# EAGLE design ESPRemote (EAGLE 9.3.2)
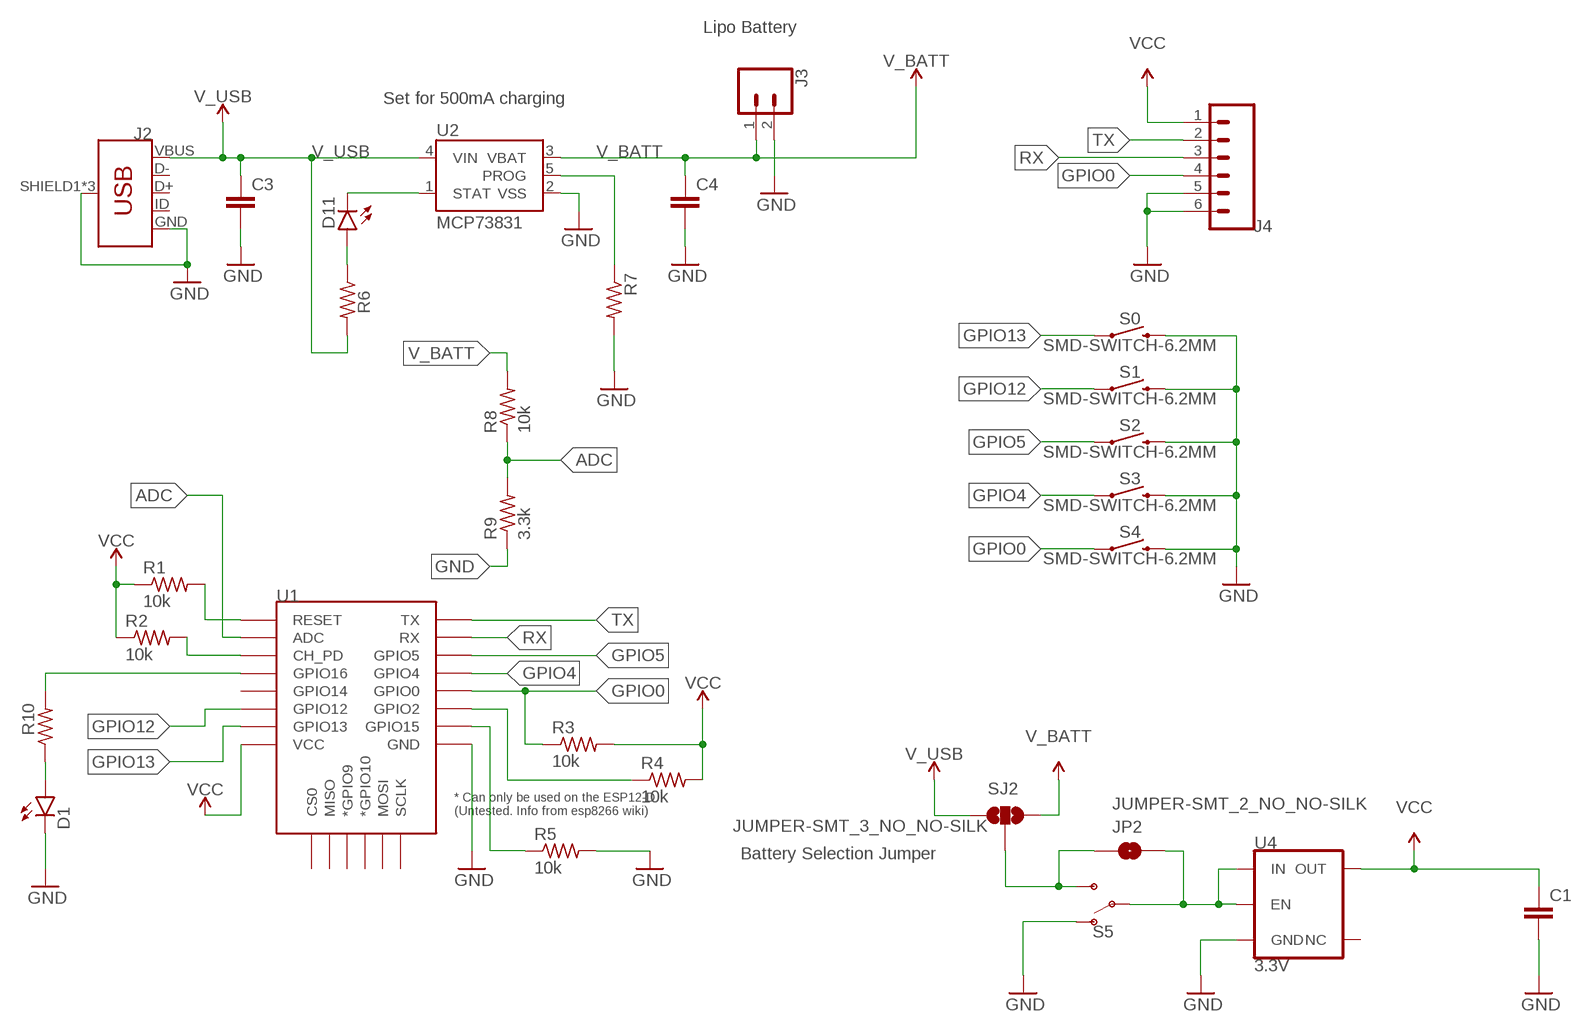
[diagram p0: schematic, sheet 1]

## Parts
C1  10UF  [C0603]
C3  10UF  [C0603]
C4  10UF  [C0603]
D1  BLUE  LEDCHIP-LED0805  [CHIP-LED0805]
D11  RED  LEDCHIP-LED0805  [CHIP-LED0805]
J2  USB_MICRO-B_FEMALE-SMT  [USB-B-MICRO-SMD]
J3  CONN_02  [1X02]
J4  CONN_06SMD-1MM  [1X06-1MM]
JP2  JUMPER-SMT_2_NO_NO-SILK  [SMT-JUMPER_2_NO_NO-SILK]
R1  10k  R-US_R1206  [R1206]
R2  10k  R-US_R1206  [R1206]
R3  10k  R-US_R1206  [R1206]
R4  10k  R-US_R1206  [R1206]
R5  10k  R-US_R1206  [R1206]
R6  1k  R-US_R1206  [R1206]
R7  2.0k  R-US_R1206  [R1206]
R8  10k  R-US_R1206  [R1206]
R9  3.3k  R-US_R1206  [R1206]
R10  330  R-US_R1206  [R1206]
S0  SMD-SWITCH-6.2MM  MOMENTARY-SWITCH-SPST-SMD-6.0X3.5MM  [TACTILE_SWITCH_SMD_6.0X3.5MM]
S1  SMD-SWITCH-6.2MM  MOMENTARY-SWITCH-SPST-SMD-6.0X3.5MM  [TACTILE_SWITCH_SMD_6.0X3.5MM]
S2  SMD-SWITCH-6.2MM  MOMENTARY-SWITCH-SPST-SMD-6.0X3.5MM  [TACTILE_SWITCH_SMD_6.0X3.5MM]
S3  SMD-SWITCH-6.2MM  MOMENTARY-SWITCH-SPST-SMD-6.0X3.5MM  [TACTILE_SWITCH_SMD_6.0X3.5MM]
S4  SMD-SWITCH-6.2MM  MOMENTARY-SWITCH-SPST-SMD-6.0X3.5MM  [TACTILE_SWITCH_SMD_6.0X3.5MM]
S5  SWITCH-SPDT-SMD-RIGHT-ANGLE  [SWITCH_SPST_SMD_A]
SJ2  JUMPER-SMT_3_NO_NO-SILK  [SMT-JUMPER_3_NO_NO-SILK]
U1  ESP12ESMD  [ESP12E-SMD]
U2  MCP73831  [SOT23-5]
U4  3.3V  V_REG_AP2112K-3.3V  [SOT23-5]

## Nets
ADC: R8.1 R9.2 U1.ADC
GND: C1.2 C3.2 C4.2 D1.C J2.GND J2.SHIELD1(SHIELD) J2.SHIELD2(SHIELD) J2.SHIELD3(SHIELD) J3.2 J4.5 J4.6 R5.2 R7.2 R9.1 S0.2 S1.2 S2.2 S3.2 S4.2 S5.1(O) U1.GND U2.2(VSS) U4.2(GND)
GPIO0: J4.4 R3.1 S4.1 U1.GPIO0
GPIO4: S3.1 U1.GPIO4
GPIO5: S2.1 U1.GPIO5
GPIO12: S1.1 U1.GPIO12
GPIO13: S0.1 U1.GPIO13
N$1: JP2.2 S5.2(P) U4.1(IN) U4.3(EN)
N$2: R1.2 U1.RESET
N$3: D11.A R6.1
N$4: R2.2 U1.CH_PD
N$5: R4.1 U1.GPIO2
N$6: JP2.1 S5.3(S) SJ2.2
N$7: R5.1 U1.GPIO15
N$8: R10.2 U1.GPIO16
N$9: D1.A R10.1
PROG: R7.1 U2.5(PROG)
RX: J4.3 U1.RXD0(RX)
STAT: D11.C U2.1(STAT)
TX: J4.2 U1.TXD0(TX)
V_BATT: C4.1 J3.1 R8.2 SJ2.3 U2.3(VBAT)
V_USB: C3.1 J2.VBUS R6.2 SJ2.1 U2.4(VIN)
VCC: C1.1 J4.1 R1.1 R2.1 R3.2 R4.2 U1.VCC U4.5(OUT)
Unconnected: J2.D+ J2.D- J2.ID U1.CS0 U1.GPIO9(*GPIO9) U1.GPIO10(*GPIO10) U1.GPIO14 U1.MISO U1.MOSI U1.SCLK U4.4(NC)

## Notes on the sheet
- Lipo Battery
- Set for 500mA charging
- Battery Selection Jumper

## Library data of the parts
C1 C3 C4 = SparkFun-Capacitors:10UF: 10.0µF ceramic capacitors A capacitor is a passive two-terminal electrical component used to store electrical energy temporarily in an electric field.
D1 D11 = led:LED: LED OSRAM: - CHIPLED LG R971, LG N971, LY N971, LG Q971, LY Q971, LO R971, LY R971 LH N974, LH R974 LS Q976, LO Q976, LY Q976 LO Q996 - Hyper CHIPLED LW Q18S LB Q993, LB Q99A, LB R99A - SideLED LS A670, LO A670, LY A670, LG A670, LP A670 LB A673, LV A673, LT A673, LW A673 LH A674 LY A675 LS A676, LA A676, LO A676, LY A676, LW A676 LS A679, LY A679, LG A679 - Hyper Micro SIDELED® LS Y876, LA Y876, LO Y876, LY Y876 LT Y87S - SmartLED LW L88C, LW L88S LB L89C, LB L89S, LG L890 LS L89K, LO L89K, LY L89K LS L896, LA L896, LO L896, LY L896 - TOPLED LS T670, LO T670, LY T670, LG T670, LP T670 LSG T670, LSP T670, LSY T670, LOP T670, LYG T670 LG T671, LOG T671, LSG T671 LB T673, LV T673, LT T673, LW T673 LH T674 LS T676, LA T676, LO T676, LY T676, LB T676, LH T676, LSB T676, LW T676 LB T67C, LV T67C, LT T67C, LS T67K, LO T67K, LY T67K, LW E67C LS E67B, LA E67B, LO E67B, LY E67B, LB E67C, LV E67C, LT E67C LW T67C LS T679, LY T679, LG T679 LS T770, LO T770, LY T770, LG T770, LP T770 LB T773, LV T773, LT T773, LW T773 LH T774 LS E675, LA E675, LY E675, LS T675 LS T776, LA T776, LO T776, LY T776, LB T776 LHGB T686 LT T68C, LB T68C - Hyper Mini TOPLED® LB M676 - Mini TOPLED Santana® LG M470 LS M47K, LO M47K, LY M47K Source: http://www.osram.convergy.de LUXEON: - LUMILED® LXK2-PW12-R00, LXK2-PW12-S00, LXK2-PW14-U00, LXK2-PW14-V00 LXK2-PM12-R00, LXK2-PM12-S00, LXK2-PM14-U00 LXK2-PE12-Q00, LXK2-PE12-R00, LXK2-PE12-S00, LXK2-PE14-T00, LXK2-PE14-U00 LXK2-PB12-K00, LXK2-PB12-L00, LXK2-PB12-M00, LXK2-PB14-N00, LXK2-PB14-P00, LXK2-PB14-Q00 LXK2-PR12-L00, LXK2-PR12-M00, LXK2-PR14-Q00, LXK2-PR14-R00 LXK2-PD12-Q00, LXK2-PD12-R00, LXK2-PD12-S00 LXK2-PH12-R00, LXK2-PH12-S00 LXK2-PL12-P00, LXK2-PL12-Q00, LXK2-PL12-R00 Source: www.luxeon.com KINGBRIGHT: KA-3528ASYC Source: www.kingbright.com
J2 = SparkFun-Connectors:USB_MICRO-B: USB Type Micro-B Connector Male/female and PTH/SMT variants SparkFun Products: SparkFun microB USB Breakout <https://www.sparkfun.com/products/12035> SparkFun USB microB Plug Breakout <https://www.sparkfun.com/products/10031> SparkFun ESP8266 Thing <https://www.sparkfun.com/products/13231>; PROD_ID: CONN-11752
J3 = SparkFun-Connectors:CONN_02: Multi connection point. Often used as Generic Header-pin footprint for 0.1 inch spaced/style header connections On any of the 0.1 inch spaced packages, you can populate with these: Break Away Headers - Straight <https://www.sparkfun.com/products/116> (PRT-00116) Break Away Male Headers - Right Angle <https://www.sparkfun.com/products/553> (PRT-00553) Female Headers <https://www.sparkfun.com/products/115> (PRT-00115) Break Away Headers - Machine Pin <https://www.sparkfun.com/products/117> (PRT-00117) Break Away Female Headers - Swiss Machine Pin <https://www.sparkfun.com/products/743> (PRT-00743) For SCREWTERMINALS and SPRING TERMINALS visit here: Screw Terimnals on SparkFun.com <https://www.sparkfun.com/search/results?term=Screw+Terminals> (5mm/3.5mm/2.54mm spacing) This device is also useful as a general connection point to wire up your design to another part of your project. Our various solder wires solder well into these plated through hole pads. Hook-Up Wire - Assortment (Stranded, 22 AWG) <https://www.sparkfun.com/products/11375> (PRT-11375) Hook-Up Wire - Assortment (Solid Core, 22 AWG) <https://www.sparkfun.com/products/11367> (PRT-11367) View the entire wire category on our website here <https://www.sparkfun.com/categories/141> Special notes: Molex polarized connector foot print use with: PRT-08233 with associated crimp pins and housings. 2.54_SCREWTERM for use with PRT-10571. 3.5mm Screw Terminal footprints for PRT-08084 5mm Screw Terminal footprints for use with PRT-08432
J4 = SparkFun-Connectors:CONN_06: Multi connection point. Often used as Generic Header-pin footprint for 0.1 inch spaced/style header connections On any of the 0.1 inch spaced packages, you can populate with these: Break Away Headers - Straight <https://www.sparkfun.com/products/116> (PRT-00116) Break Away Male Headers - Right Angle <https://www.sparkfun.com/products/553> (PRT-00553) Female Headers <https://www.sparkfun.com/products/115> (PRT-00115) Break Away Headers - Machine Pin <https://www.sparkfun.com/products/117> (PRT-00117) Break Away Female Headers - Swiss Machine Pin <https://www.sparkfun.com/products/743> (PRT-00743) Arduino Stackable Header - 6 Pin <https://www.sparkfun.com/products/9280> (PRT-09280) For SCREWTERMINALS and SPRING TERMINALS visit here: Screw Terimnals on SparkFun.com <https://www.sparkfun.com/search/results?term=Screw+Terminals> (5mm/3.5mm/2.54mm spacing) This device is also useful as a general connection point to wire up your design to another part of your project. Our various solder wires solder well into these plated through hole pads. Hook-Up Wire - Assortment (Stranded, 22 AWG) <https://www.sparkfun.com/products/11375> (PRT-11375) Hook-Up Wire - Assortment (Solid Core, 22 AWG) <https://www.sparkfun.com/products/11367> (PRT-11367) View the entire wire category on our website here <https://www.sparkfun.com/categories/141>; PROD_ID: CONN-08249; SF_ID: GPS-00579
JP2 = SparkFun-Jumpers:JUMPER-SMT_2_NO: Normally open jumper This jumper has two pads in close proximity to each other. Apply solder to close the connection. Round pads are easier to solder for beginners, but are a lot larger. SparkFun Product that uses the round pads: SparkFun EL Sequencer <https://www.sparkfun.com/products/12781>
R1-R10 = audio amplifier example:R-US_: RESISTOR, American symbol
S0 S1-S4 = SparkFun-Switches:MOMENTARY-SWITCH-SPST: Momentary Switch (Pushbutton) - SPST Normally-open (NO) SPST momentary switches (buttons, pushbuttons). Variants PTH-12MM - 12mm square, through-hole Momentary Pushbutton Switch - 12mm Square <https://www.sparkfun.com/products/9190> (COM-09190) PTH-6.0MM, PTH-6.0MM-KIT - 6.0mm square, through-hole Mini Pushbutton Switch <https://www.sparkfun.com/products/97> (COM-00097) KIT package intended for soldering kit's - only one side of pads' copper is exposed. PTH-RIGHT-ANGLE-KIT - Right-angle, through-hole Right Angle Tactile Button <https://www.sparkfun.com/products/10791> - Used on SparkFun BigTime Watch Kit <https://www.sparkfun.com/products/11734> SMD-12MM - 12mm square, surface-mount Tactile Button - SMD (12mm) <https://www.sparkfun.com/products/12993> (COM-12993) Used on SparkFun PicoBoard <https://www.sparkfun.com/products/11888> SMD-4.5MM - 4.5mm Square Trackball Switch Used on SparkFun Blackberry Trackballer Breakout <https://www.sparkfun.com/products/13169> SMD-4.6MMX2.8MM - 4.60mm x 2.80mm, surface mount Used on SparkFun SAMD21 Mini Breakout <https://www.sparkfun.com/products/13664> SMD-5.2MM, SMD-5.2-REDUNDANT - 5.2mm square, surface-mount Mini Pushbutton Switch - SMD <https://www.sparkfun.com/products/8720> (COM-08720) Used on Arduino Pro Mini <https://www.sparkfun.com/products/11114> REDUNDANT package connects both switch circuits together SMD-6.0X3.5MM - 6.0 x 3.5mm, surface mount Momentary Reset Switch SMD <https://www.sparkfun.com/products/8229> (COM-08229) SMD-6.2MM-TALL - 6.2mm square, surface mount Tactile Button - SMD (6mm) <https://www.sparkfun.com/products/12992> Used on SparkFun Digital Sandbox <https://www.sparkfun.com/products/12651> SMD-RIGHT-ANGLE - Right-angle, surface mount Used on SparkFun Block for Intel® Edison - Arduino <https://www.sparkfun.com/products/13036>; PROD_ID: SWCH-00815; SF_SKU: COM-08229
S5 = SparkFun-Switches:SWITCH-SPDT: Single Pole, Double Throw (SPDT) Switch Single-pole, double-throw (SPDT) switch. Variant Overview SMD-AYZ0202 Surface Mount DPDT Switch <https://www.sparkfun.com/products/597> (COM-00597) Used on e.g. LilyPad Arduino USB - ATmega32U4 Board <https://www.sparkfun.com/products/12049> PTH-11.6X4.0MM SPDT Mini Power Switch <https://www.sparkfun.com/products/102> (COM-00102) Used on e.g. SparkFun Simon Says - Through-Hole Soldering Kit <https://www.sparkfun.com/products/10547> (KIT-10547) PTH-11.6X4.0MM-KIT KIT version of SPDT Mini Power Switch - Simplifies soldering by removing tStop of switch pins - only one side can be soldered. PTH-11.6X4.0MM-LOCK LOCK version of SPDT Mini Power Switch - Offset pins hold switch in place for easier soldering. SMD-RIGHT-ANGLE Surface Mount Right Angle Switch <https://www.sparkfun.com/products/10860> (COM-10860) Used on e.g. SparkFun ESP8266 Thing <https://www.sparkfun.com/products/13231>; PROD_ID: SWCH-10651; SF_SKU: COM-10860
SJ2 = SparkFun-Jumpers:JUMPER-SMT_3_NO: Normally open jumper This jumper has three pads in close proximity to each other. Apply solder to close the connection(s).
U1 = esp8266modules:ESP12E: ESP12E Module; SPICEPREFIX: X
U2 = SparkFun-IC-Power:MCP73831: MCP73831T Li-Ion, Li-Pol Controller Miniature single cell, fully integrated Li-Ion, Li-polymer charge management controller Datasheet <http://ww1.microchip.com/downloads/en/DeviceDoc/20001984g.pdf> SparkFun Products: SparkFun ESP32 Thing <https://www.sparkfun.com/products/13907> SparkFun 9DoF Razor IMU M0 <https://www.sparkfun.com/products/14001>; PROD_ID: IC-09995
U4 = SparkFun-IC-Power:V_REG_AP2112: AP2112 - 600mA CMOS LDO Regulator w/ Enable The AP2112 is CMOS process low dropout linear regulator with enable function, the regulator delivers a guaranteed 600mA (min.) continuous load current. Features Output Voltage Accuracy: ±1.5% Output Current: 600mA (Min.) Foldback Short Current Protection: 50mA Enable Function to Turn ON/OFF VOUT Low Dropout Voltage (3.3V): 250mV (Typ.) @IOUT=600mA Excellent Load Regulation: 0.2%/A (Typ.) Excellent Line Regulation: 0.02%/V (Typ.) Low Quiescent Current: 55μA (Typ.) Low Standby Current: 0.01μA (Typ.) Low Output Noise: 50μVRMS PSRR: 100Hz -65dB, 1kHz -65dB OTSD Protection Stable with 1.0μF Flexible Cap: Ceramic, Tantalum and Aluminum Electrolytic Operation Temperature Range: -40°C to 85°C ESD: MM 400V, HBM 4000V; PROD_ID: VREG-12457

## Board
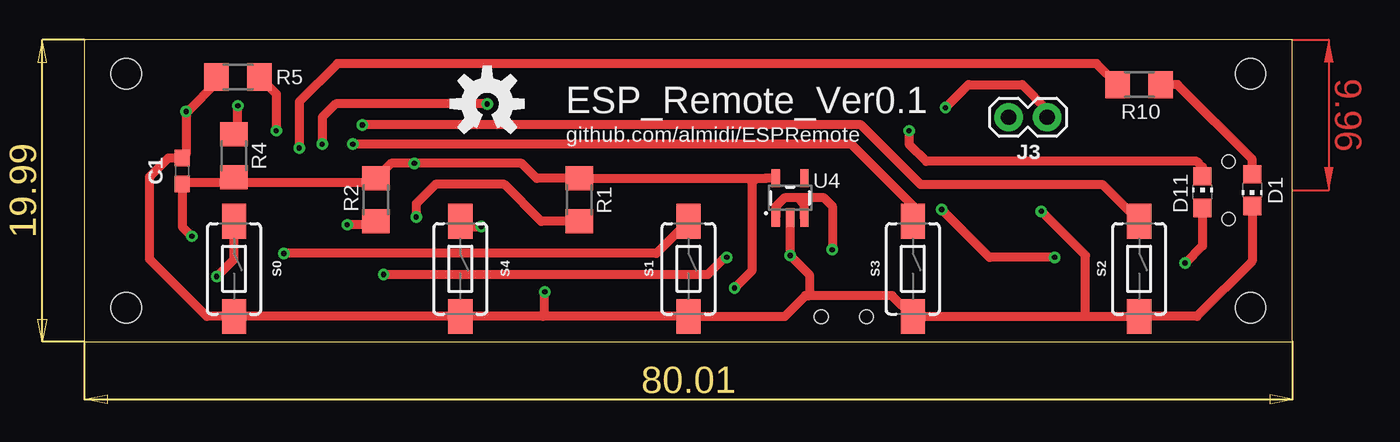
[diagram p1: board, top side]
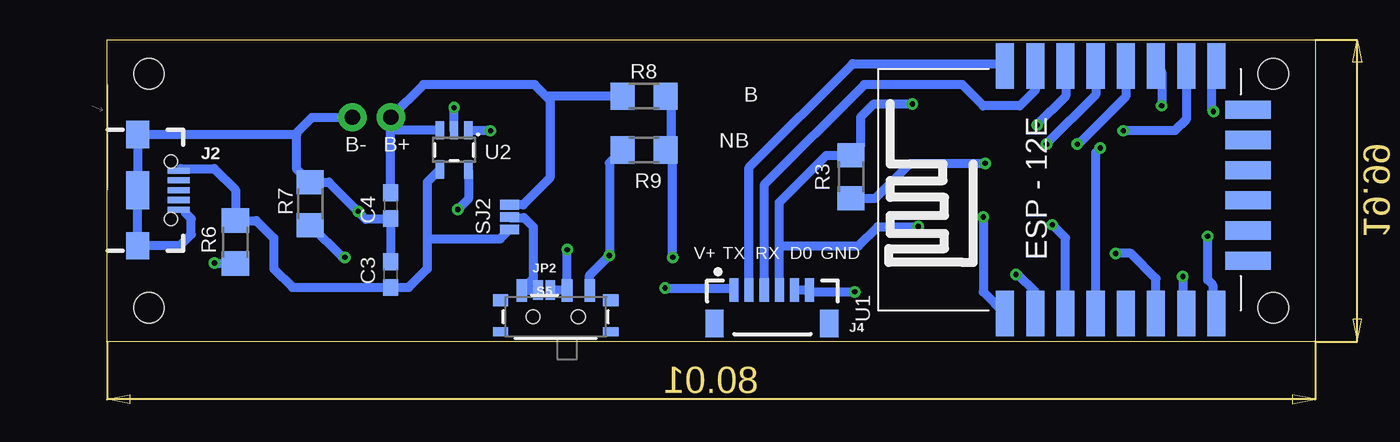
[diagram p2: board, bottom side, seen from below]

Size 79.99 x 19.99 mm. Coordinates in mm from the lower left corner, seen from the top.
Outline: 0,0 79.99,0 79.99,19.99 0,19.99 0,0
Copper layers (1*16): Top 0.035mm / dielectric 1.5mm / Bottom 0.035mm
Design rules "default *": minimum track width 6mil, minimum drill 0.35mm, track to track 6mil, track to pad 6mil, pad to pad 6mil, via to via 6mil, smd to smd 6mil, copper to edge 0.2mm, drill to drill 6mil, minimum pad ring 10mil, minimum via ring 8mil, stop-mask expansion 4mil, vias tented up to drill 0mil, thermal gap 10mil
Holes 2 mm at 2.76,17.75 2.76,2.25 77.24,2.25 77.24,17.75

### Footprints (pad centres in the part's own frame; a part is rotated, then mirrored left to right if it is on the bottom)
C0603 = smd 1.1 x 1: 1 -0.85,0; 2 0.85,0
CHIP-LED0805 = smd 1.2 x 1.2: A 0,-1.05; C 0,1.05
USB-B-MICRO-SMD = smd 1.45 x 0.4: D+ 2.725,0; D- 2.725,0.65; GND 2.725,-1.3; ID 2.725,-0.65; VBUS 2.725,1.3 | smd 1.5 x 1.8: SHIELD1 0,3.685; SHIELD2 0,-3.685 | smd 1.5 x 2.5: SHIELD3 0,0 | hole 0.85: 2.2,1.9; 2.2,-1.9
1X02 = drill 1.016 pad 1.88: 1 0,0; 2 2.54,0
1X06-1MM = smd 0.6 x 1.55: 1 -2.54,1.27; 2 -1.54,1.27; 3 -0.54,1.27; 4 0.46,1.27; 5 1.46,1.27; 6 2.46,1.27 | smd 1.2 x 1.8: P$1 -3.84,-0.955; P$2 3.76,-0.955
SMT-JUMPER_2_NO_NO-SILK = smd 0.635 x 1.27: 1 -0.406,0; 2 0.406,0
R1206 = smd 1.6 x 1.803: 1 -1.422,0; 2 1.422,0
TACTILE_SWITCH_SMD_6.0X3.5MM = smd 2.3 x 1.6: 1 -3.15,0; 2 3.15,0
SWITCH_SPST_SMD_A = smd 0.7 x 1.5: 1 -2.25,-1.75; 2 -0.75,-1.75; 3 2.25,-1.75 | smd 1 x 0.6: GND1 -3.65,1; GND3 3.65,1 | smd 1 x 0.8: GND2 -3.65,-1.1; GND4 3.65,-1.1 | hole 0.9: -1.5,0; 1.5,0
SMT-JUMPER_3_NO_NO-SILK = smd 0.635 x 1.27: 1 -0.813,0; 2 0,0; 3 0.813,0
ESP12E-SMD = smd 3 x 1.2: ADC -8.3,3.8; CH_PD -8.3,1.8; GND 8.1,-8.2; GPIO0 8.1,-2.2; GPIO2 8.1,-4.2; GPIO4 8.1,-0.2; GPIO5 8.1,1.8; GPIO12 -8.3,-4.2; GPIO13 -8.3,-6.2; GPIO14 -8.3,-2.2; GPIO15 8.1,-6.2; GPIO16 -8.3,-0.2; RESET -8.3,5.8; RXD0 8.1,3.8; TXD0 8.1,5.8; VCC -8.3,-8.2 | smd 1.2 x 3: CS0 -4.8,-10.3; GPIO9 -0.8,-10.3; GPIO10 1.2,-10.3; MISO -2.8,-10.3; MOSI 3.2,-10.3; SCLK 5.2,-10.3
SOT23-5 = smd 0.55 x 1.2: 1 -0.95,-1.3; 2 0,-1.3; 3 0.95,-1.3; 4 0.95,1.3; 5 -0.95,1.3

### Placement (x,y rotation side)
C1  6.48,11.3 90 top
C3  61.21,4.45 90 bottom
C4  61.21,9.02 270 bottom
D1  77.34,10.03 180 top
D11  74.04,9.91 0 top
J2  77.98,10.03 0 bottom
J3  61.21,14.86 0 top
J4  35.94,2.16 0 bottom
JP2  51.05,3.43 0 bottom
R1  32.77,9.4 270 top
R2  19.3,9.4 270 top
R3  30.73,10.92 270 bottom
R4  9.91,12.32 270 top
R5  10.16,17.53 180 top
R6  71.5,6.6 90 bottom
R7  66.55,9.14 90 bottom
R8  44.45,16.26 180 bottom
R9  44.45,12.7 0 bottom
R10  69.85,17.02 180 top
S0  9.91,4.83 270 top
S1  40.01,4.83 270 top
S2  69.85,4.83 270 top
S3  54.86,4.83 270 top
S4  24.89,4.83 270 top
S5  50.29,1.65 180 bottom
SJ2  53.34,8.26 90 bottom
U1  14.73,10.16 90 bottom
U2  57.02,12.7 180 bottom
U4  46.74,9.53 0 top
U$2  [OSHW-LOGO-M]  26.67,15.75 0 top

### Tracks (layer width: path | path; a pad name or v marks a point on that pad's centre or on a via)
ADC  (via drill 0.35)
  Top 0.61: v19.81,4.45 41.27,4.45 42.42,5.59 v42.55,5.59
  Bottom 0.61: U1.ADC 18.53,3.3 19.68,4.45 v19.81,4.45 | v42.55,5.59 42.55,12.22 R9.2 42.65,13.08 42.65,15.88 R8.1
GND  (via drill 0.35)
  Top 0.152: S0.2 9.91,2.29 | S4.2 24.89,2.29
  Top 0.61: 77.22,8.86 D1.C 77.34,5.33 73.69,1.68 S2.2 | S2.2 69.32,1.68 | 48.01,3.05 53.49,3.05 S3.2 66.29,1.68 | 48.01,3.05 47.75,3.05 46.38,1.68 S1.2 30.35,1.68 | 30.35,1.68 S4.2 S0.2 8.1,1.68 4.32,5.46 4.32,10.92 5.55,12.15 C1.2 6.73,12.41 v6.73,15.24 6.71,15.27 6.86,15.27 8.74,17.14 R5.2 | 48.01,3.05 48.01,4.45 v46.74,5.71 U4.2 | 66.29,1.68 S2.2 | v57.02,15.49 58.55,17.02 62.1,17.02 63.75,15.37 J3.2 | 30.35,1.68 30.48,1.8 v30.48,3.3 | 66.29,1.68 66.29,5.71 v63.37,8.64
  Bottom 0.406: J2.GND 74.9,8.73 74.8,8.64 74.8,8.51
  Bottom 0.61: 66.42,10.58 R7.2 | U1.GND 6.86,18.59 6.86,15.37 v6.73,15.24 | 67.57,13.72 67.44,13.72 67.44,11.4 66.6,10.57 R7.2 | 67.57,13.72 J2.SHIELD1 J2.SHIELD3 J2.SHIELD2 75.19,6.35 74.42,7.11 74.42,8.13 74.8,8.51 | U2.2 v57.02,15.49 | 67.57,13.72 66.42,14.86 J3.2 | C3.2 C4.2 61.28,8.1 62.87,8.1 63.37,8.61 | 34.48,3.56 J4.5 J4.6 33.35,3.3 v30.48,3.3 | S5.1 48.04,4.41 v46.74,5.71 46.74,11.84 R9.1 | R7.2 65.33,10.57 63.37,8.61 | 63.37,8.61 v63.37,8.64
GPIO0  (via drill 0.35)
  Top 0.61: v26.67,15.75 16.64,15.75 15.75,14.86 v15.75,13.08 | S4.1 25.25,7.62 v26.29,7.62
  Bottom 0.61: v15.75,13.08 15.71,13.05 12.53,16.23 U1.GPIO0 | v26.67,15.75 29.21,15.75 30.1,14.86 30.1,12.98 R3.1 32.36,12.34 35.48,9.22 35.48,6.35 | J4.4 35.48,6.35 | v26.29,7.62 28.96,7.62 30.23,6.35 35.48,6.35
GPIO4  (via drill 0.35)
  Top 0.61: S3.1 54.86,9.02 50.8,13.08 v17.78,13.08
  Bottom 0.61: U1.GPIO4 14.53,16.36 17.78,13.11 v17.78,13.08
GPIO5  (via drill 0.35)
  Top 0.61: v18.41,14.35 51.44,14.35 55.37,10.41 67.41,10.41 S2.1
  Bottom 0.61: v18.41,14.35 16.51,16.26 16.51,18.24 U1.GPIO5
GPIO12  (via drill 0.35)
  Top 0.61: S1.1 37.87,5.84 v13.21,5.84
  Bottom 0.61: U1.GPIO12 10.53,4.18 12.19,5.84 v13.21,5.84
GPIO13  (via drill 0.35)
  Top 0.61: v8.76,4.32 9.91,5.46 S0.1
  Bottom 0.61: v8.76,4.32 8.76,2.09 U1.GPIO13
N$1  (via drill 0.35)
  Top 0.61: v49.53,6.1 49.53,8.98 48.99,9.53 47.24,9.53 | U4.3 47.69,9.08 47.24,9.53 | 47.24,9.53 46.35,9.53 45.79,8.96 U4.1
  Bottom 0.61: JP2.2 49.57,3.43 S5.2 49.53,3.41 v49.53,6.1
N$2  (via drill 0.35)
  Top 0.61: 21.95,8.28 v21.97,8.26 21.97,9.14 23.24,10.41 27.81,10.41 30.25,7.98 R1.2
  Bottom 0.61: 20.53,2.88 U1.RESET 21.97,3.3 v21.97,8.26
N$3  (via drill 0.35)
  Top 0.61: D11.A 74.04,6.35 v72.9,5.21
  Bottom 0.61: v72.9,5.21 71.53,5.21 R6.1
N$4  (via drill 0.35)
  Top 0.61: R2.2 19.07,7.75 v17.4,7.75
  Bottom 0.61: U1.CH_PD 16.53,6.88 v17.4,7.75
N$5  (via drill 0.35)
  Top 0.61: R4.1 10.16,13.99 v10.16,15.62
  Bottom 0.61: U1.GPIO2 10.16,17.89 v10.16,15.62
N$6
  Bottom 0.61: SJ2.2 53.34,8.22 52.39,8.22 51.78,7.61 51.78,4.16 S5.3 51.49,3.4 JP2.1
N$7  (via drill 0.35)
  Top 0.61: R5.1 12.7,16.41 v12.7,13.97
  Bottom 0.61: U1.GPIO15 8.53,14.71 9.27,13.97 v12.7,13.97
N$8  (via drill 0.35)
  Top 0.61: R10.2 67.03,18.41 16.76,18.41 14.22,15.88 v14.22,12.83
  Bottom 0.61: U1.GPIO16 14.53,12.52 v14.22,12.83
N$9
  Top 0.61: D1.A 77.34,12.06 72.39,17.02 R10.1
PROG  (via drill 0.35)
  Top 0.61: v64.26,5.59 59.94,5.59 v56.77,8.76
  Bottom 0.61: U2.5 56.07,9.46 v56.77,8.76 | R7.1 64.41,5.59 v64.26,5.59
RX
  Bottom 0.61: 36.45,3.46 J4.3 36.48,10.38 29.84,17.02 23.37,17.02 21.97,15.62 19.56,15.62 18.53,16.65 U1.RXD0
STAT  (via drill 0.35)
  Top 0.61: D11.C 74.04,11.56 73.66,11.94 55.75,11.94 54.61,13.08 v54.61,13.97
  Bottom 0.61: U2.1 54.89,14 54.86,13.97 v54.61,13.97
TX
  Bottom 0.61: J4.2 37.48,11.54 30.61,18.41 20.53,18.41 U1.TXD0
V_BATT
  Bottom 0.61: SJ2.3 52.45,9.07 50.67,10.85 50.67,16 50.93,16.26 | 50.93,16.26 51.69,17.02 59.05,17.02 J3.1 61.21,14.1 | R8.2 50.93,16.26 | C4.1 61.21,14.1 | 61.21,14.1 61.12,14 U2.3
V_USB
  Bottom 0.152: J2.VBUS 75.13,11.46
  Bottom 0.406: J2.VBUS 74.9,11.33
  Bottom 0.61: C3.1 61.25,3.56 | C3.1 60.03,3.6 58.8,4.83 58.8,6.81 | 75.13,11.46 72.9,11.46 71.5,10.06 R6.2 70.13,8.03 68.96,6.86 68.96,4.83 67.73,3.6 C3.1 | U2.4 58.8,10.57 58.8,6.81 | 58.8,6.81 53.98,6.81 SJ2.1
VCC  (via drill 0.35)
  Top 0.61: v7.11,6.99 6.48,7.62 C1.1 6.54,10.52 9.53,10.52 R4.2 10.26,10.54 19.02,10.54 R2.1 | R2.1 19,10.52 | v43.05,3.56 44.2,4.7 44.2,10.54 44.48,10.82 | U4.5 45.12,10.82 45.11,10.82 44.48,10.82 | R2.1 19.15,10.67 | R2.1 20.3,11.81 v21.84,11.81 28.96,11.81 29.95,10.82 R1.1 44.48,10.82
  Bottom 0.61: v7.11,6.99 7.11,4.09 6.79,3.77 6.79,2.11 U1.VCC | 30.61,9.37 R3.2 29.11,9.5 26.8,11.81 v21.84,11.81 | v43.05,3.56 38.61,3.56 J4.1
(copper drawn outside any net)
  shapes: Top area x1

### Text on the board
tNames: ESP_Remote_Ver0.1 | github.com/almidi/ESPRemote
bNames: B | NB | B+ | B- | GND | D0 | RX | TX | V+